# EAGLE schematic Robot (EAGLE 6.5.0)

## Sheet 1 of 4
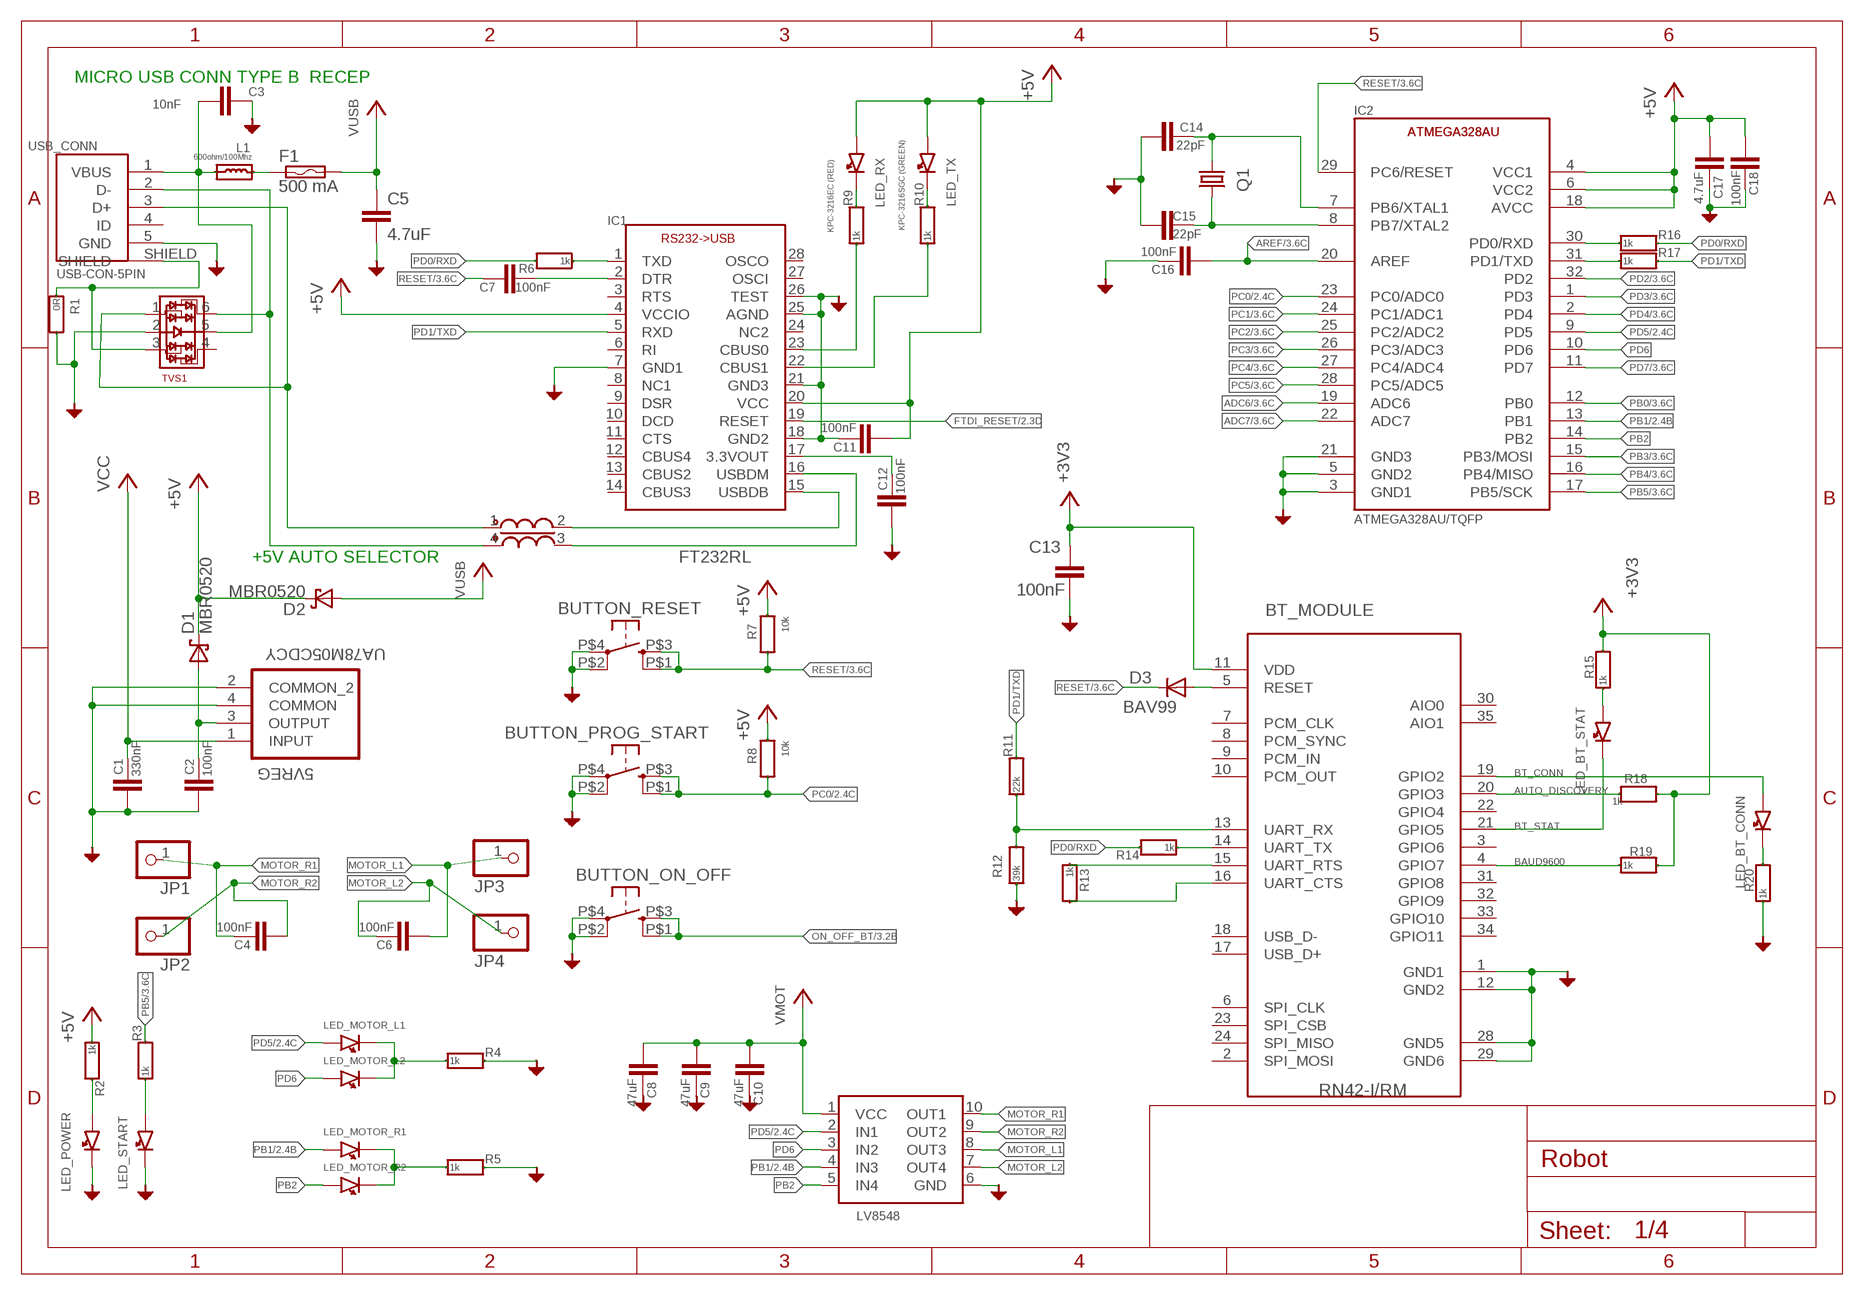
[diagram p0: schematic, sheet 1]

### Parts
5VREG  UA78M05CDCY  [SOT230P700X180-4N]
BT_MODULE  RN42-I/RM  BLUETOOTH-RN42"  [RN42]
BUTTON_ON_OFF  KSC921J  [TACT_SWITCH_4_PIN]
BUTTON_PROG_START  KSC921J  [TACT_SWITCH_4_PIN]
BUTTON_RESET  KSC921J  [TACT_SWITCH_4_PIN]
C1  330nF  C-EUC0805  [C0805]
C2  100nF  C-EUC0805  [C0805]
C3  10nF  C-EUC0805  [C0805]
C4  100nF  C-EUC0805  [C0805]
C5  4.7uF  C-EUC0805  [C0805]
C6  100nF  C-EUC0805  [C0805]
C7  100nF  C-EUC0805  [C0805]
C8  47uF  C-EUC1210  [C1210]
C9  47uF  C-EUC1210  [C1210]
C10  47uF  C-EUC1210  [C1210]
C11  100nF  C-EUC0805  [C0805]
C12  100nF  C-EUC0805  [C0805]
C13  100nF  C-EUC0805  [C0805]
C14  22pF  C-EUC0805  [C0805]
C15  22pF  C-EUC0805  [C0805]
C16  100nF  C-EUC0805  [C0805]
C17  4.7uF  C-EUC0805  [C0805]
C18  100nF  C-EUC0805  [C0805]
D1  MBR0520  [SOD123]
D2  MBR0520  [SOD123]
D3  BAV99  D-A1-C3  [SOT23]
F1  500 mA  POLYSWITCH  [PT1206]
IC1  FT232RL  [SSOP28]
IC2  ATMEGA328AU/TQFP  ATMEGA328AU  [TQFP32-08]
JP1  1X01 PIN  PINHD-1X1  [1X01]
JP2  1X01 PIN  PINHD-1X1  [1X01]
JP3  1X01 PIN  PINHD-1X1  [1X01]
JP4  1X01 PIN  PINHD-1X1  [1X01]
L1  600ohm/100Mhz  INDUCTOR_0603_600R  [R0603]
LED_BT_CONN  KPC-3216SGC  SMDLED_3216  [LED3216_PAC]
LED_BT_STAT  KPC-3216SGC  SMDLED_3216  [LED3216_PAC]
LED_MOTOR_L1  APT3216QBC/D (BLUE)  SMDLED_3216  [LED3216_PAC]
LED_MOTOR_L2  KPC-3216YC  SMDLED_3216  [LED3216_PAC]
LED_MOTOR_R1  APT3216QBC/D (BLUE)  SMDLED_3216  [LED3216_PAC]
LED_MOTOR_R2  KPC-3216YC  SMDLED_3216  [LED3216_PAC]
LED_POWER  KPC-3216SGC (GREEN)  SMDLED_3216  [LED3216_PAC]
LED_RX  KPC-3216EC (RED)  SMDLED_3216  [LED3216_PAC]
LED_START  KPC-3216SGC  SMDLED_3216  [LED3216_PAC]
LED_TX  KPC-3216SGC (GREEN)  SMDLED_3216  [LED3216_PAC]
MOTOR_CONTROLLER  LV8548  [LV8548]
Q1  16MHz  CRYSTALSM49  [SM49]
R1  0R  MYRES_0805  [R0805]
R2  1k  MYRES_0805  [R0805]
R3  1k  MYRES_0805  [R0805]
R4  1k  MYRES_0805  [R0805]
R5  1k  MYRES_0805  [R0805]
R6  1k  MYRES_0805  [R0805]
R7  10k  MYRES_0805  [R0805]
R8  10k  MYRES_0805  [R0805]
R9  1k  MYRES_0805  [R0805]
R10  1k  MYRES_0805  [R0805]
R11  22k  MYRES_0805  [R0805]
R12  39k  MYRES_0805  [R0805]
R13  1k  MYRES_0805  [R0805]
R14  1k  MYRES_0805  [R0805]
R15  1k  MYRES_0805  [R0805]
R16  1k  MYRES_0805  [R0805]
R17  1k  MYRES_0805  [R0805]
R18  1k  MYRES_0805  [R0805]
R19  1k  MYRES_0805  [R0805]
R20  1k  MYRES_0805  [R0805]
TVS1  PRTR5V0U4Y  [SOT363]
USB_CONN  USB-CON-5PIN  [USB-MICRO-MOLEX-105017-0001_V2]
USB_FILTER  SRF3216A  [SRF3216A]

### Nets
+3V3: BT_MODULE.11(VDD) C13.1 R15.2 R18.2 R19.2 ; also sheet 2,3
+5V: C11.2 C17.2 C18.2 D1.1(K) D2.1(K) IC1.4(VCCIO) IC1.20(VCC) IC2.4(VCC1) IC2.6(VCC2) IC2.18(AVCC) LED_RX.1 LED_TX.1 R2.1 R7.2 R8.2 ; also sheet 2,3,4
ADC6: IC2.19(ADC6) ; also sheet 3
ADC7: IC2.22(ADC7) ; also sheet 3
AREF: C16.2 IC2.20(AREF) ; also sheet 3
AUTO_DISCOVERY: BT_MODULE.20(GPIO3) R18.1
BAUD9600: BT_MODULE.4(GPIO7) R19.1
BT_CONN: BT_MODULE.19(GPIO2) LED_BT_CONN.1
BT_STAT: BT_MODULE.21(GPIO5) LED_BT_STAT.2
FTDI_RESET: IC1.19(RESET) ; also sheet 2
GND: 5VREG.2(COMMON_2) 5VREG.4(COMMON) BT_MODULE.1(GND1) BT_MODULE.12(GND2) BT_MODULE.28(GND5) BT_MODULE.29(GND6) BUTTON_ON_OFF.P$2 BUTTON_ON_OFF.P$4 BUTTON_PROG_START.P$2 BUTTON_PROG_START.P$4 BUTTON_RESET.P$2 BUTTON_RESET.P$4 C1.2 C2.2 C3.1 C5.2 C8.1 C9.1 C10.1 C11.1 C12.2 C13.2 C14.2 C15.2 C16.1 C17.1 C18.1 IC1.7(GND1) IC1.18(GND2) IC1.21(GND3) IC1.25(AGND) IC1.26(TEST) IC2.3(GND1) IC2.5(GND2) IC2.21(GND3) LED_POWER.2 LED_START.2 MOTOR_CONTROLLER.6(GND) R1.2 R4.2 R5.2 R12.1 R20.1 TVS1.2 USB_CONN.5(GND) ; also sheet 2,3,4
MOTOR_L1: C6.2 JP3.1 MOTOR_CONTROLLER.8(OUT3)
MOTOR_L2: C6.1 JP4.1 MOTOR_CONTROLLER.7(OUT4)
MOTOR_L_ON: LED_MOTOR_L1.2 LED_MOTOR_L2.2 R4.1
MOTOR_R1: C4.1 JP1.1 MOTOR_CONTROLLER.10(OUT1)
MOTOR_R2: C4.2 JP2.1 MOTOR_CONTROLLER.9(OUT2)
MOTOR_R_ON: LED_MOTOR_R1.2 LED_MOTOR_R2.2 R5.1
N$1: BT_MODULE.5(RESET) D3.1(A)
N$4: IC1.1(TXD) R6.1
N$5: LED_START.1 R3.1
N$7: BT_MODULE.14(UART_TX) R14.1
N$9: BT_MODULE.15(UART_RTS) R13.1
N$10: BT_MODULE.16(UART_CTS) R13.2
N$18: IC1.15(USBDB) USB_FILTER.2
N$19: LED_BT_STAT.1 R15.1
N$21: LED_BT_CONN.2 R20.2
N$25: IC1.16(USBDM) USB_FILTER.3
N$26: BT_MODULE.13(UART_RX) R11.1 R12.2
N$27: F1.1A F1.1B L1.1
N$38: 5VREG.3(OUTPUT) C2.1 D1.2(A)
N$41: C12.1 IC1.17(3.3VOUT)
N$53: C15.1 IC2.8(PB7/XTAL2) Q1.2
N$54: C14.1 IC2.7(PB6/XTAL1) Q1.1
N$57: TVS1.1 USB_CONN.3(D+) USB_FILTER.1
N$59: TVS1.6 USB_CONN.2(D-) USB_FILTER.4
N$82: C7.1 IC1.2(DTR)
N$83: C3.2 L1.2 TVS1.5 USB_CONN.1(VBUS)
N$85: IC1.23(CBUS0) R9.1
N$86: LED_RX.2 R9.2
N$87: LED_TX.2 R10.2
N$88: IC1.22(CBUS1) R10.1
N$89: LED_POWER.1 R2.2
N$90: IC2.30(PD0/RXD) R16.1
N$91: IC2.31(PD1/TXD) R17.1
ON_OFF_BT: BUTTON_ON_OFF.P$1 BUTTON_ON_OFF.P$3 ; also sheet 3
PB0: IC2.12(PB0) ; also sheet 3,4
PB1: IC2.13(PB1) LED_MOTOR_R1.1 MOTOR_CONTROLLER.4(IN3) ; also sheet 2
PB2: IC2.14(PB2) LED_MOTOR_R2.1 MOTOR_CONTROLLER.5(IN4)
PB3: IC2.15(PB3/MOSI) ; also sheet 3,4
PB4: IC2.16(PB4/MISO) ; also sheet 3,4
PB5: IC2.17(PB5/SCK) R3.2 ; also sheet 3
PC0: BUTTON_PROG_START.P$1 BUTTON_PROG_START.P$3 IC2.23(PC0/ADC0) R8.1 ; also sheet 2
PC1: IC2.24(PC1/ADC1) ; also sheet 3,4
PC2: IC2.25(PC2/ADC2) ; also sheet 3,4
PC3: IC2.26(PC3/ADC3) ; also sheet 3,4
PC4: IC2.27(PC4/ADC4) ; also sheet 3,4
PC5: IC2.28(PC5/ADC5) ; also sheet 3,4
PD0/RXD: R6.2 R14.2 R16.2
PD1/TXD: IC1.5(RXD) R11.2 R17.2
PD2: IC2.32(PD2) ; also sheet 3
PD3: IC2.1(PD3) ; also sheet 3
PD4: IC2.2(PD4) ; also sheet 3,4
PD5: IC2.9(PD5) LED_MOTOR_L1.1 MOTOR_CONTROLLER.2(IN1) ; also sheet 2
PD6: IC2.10(PD6) LED_MOTOR_L2.1 MOTOR_CONTROLLER.3(IN2)
PD7: IC2.11(PD7) ; also sheet 3,4
RESET: BUTTON_RESET.P$1 BUTTON_RESET.P$3 C7.2 D3.3(C) IC2.29(PC6/RESET) R7.1 ; also sheet 3
SHIELD: R1.1 TVS1.3 USB_CONN.SHIELD
USB_VCC: C5.1 D2.2(A) F1.2A F1.2B ; supply symbol labelled VUSB ; also sheet 2,3
VCC: 5VREG.1(INPUT) C1.1 ; also sheet 3
VMOT: C8.2 C9.2 C10.2 MOTOR_CONTROLLER.1(VCC) ; also sheet 3
Unconnected: BT_MODULE.2(SPI_MOSI) BT_MODULE.3(GPIO6) BT_MODULE.6(SPI_CLK) BT_MODULE.7(PCM_CLK) BT_MODULE.8(PCM_SYNC) BT_MODULE.9(PCM_IN) BT_MODULE.10(PCM_OUT) BT_MODULE.17(USB_D+) BT_MODULE.18(USB_D-) BT_MODULE.22(GPIO4) BT_MODULE.23(SPI_CSB) BT_MODULE.24(SPI_MISO) BT_MODULE.30(AIO0) BT_MODULE.31(GPIO8) BT_MODULE.32(GPIO9) BT_MODULE.33(GPIO10) BT_MODULE.34(GPIO11) BT_MODULE.35(AIO1) IC1.3(RTS) IC1.6(RI) IC1.8(NC1) IC1.9(DSR) IC1.10(DCD) IC1.11(CTS) IC1.12(CBUS4) IC1.13(CBUS2) IC1.14(CBUS3) IC1.24(NC2) IC1.27(OSCI) IC1.28(OSCO) TVS1.4 USB_CONN.4(ID)

### Notes on the sheet
- MICRO USB CONN TYPE B  RECEP
- +5V AUTO SELECTOR

## Sheet 2 of 4
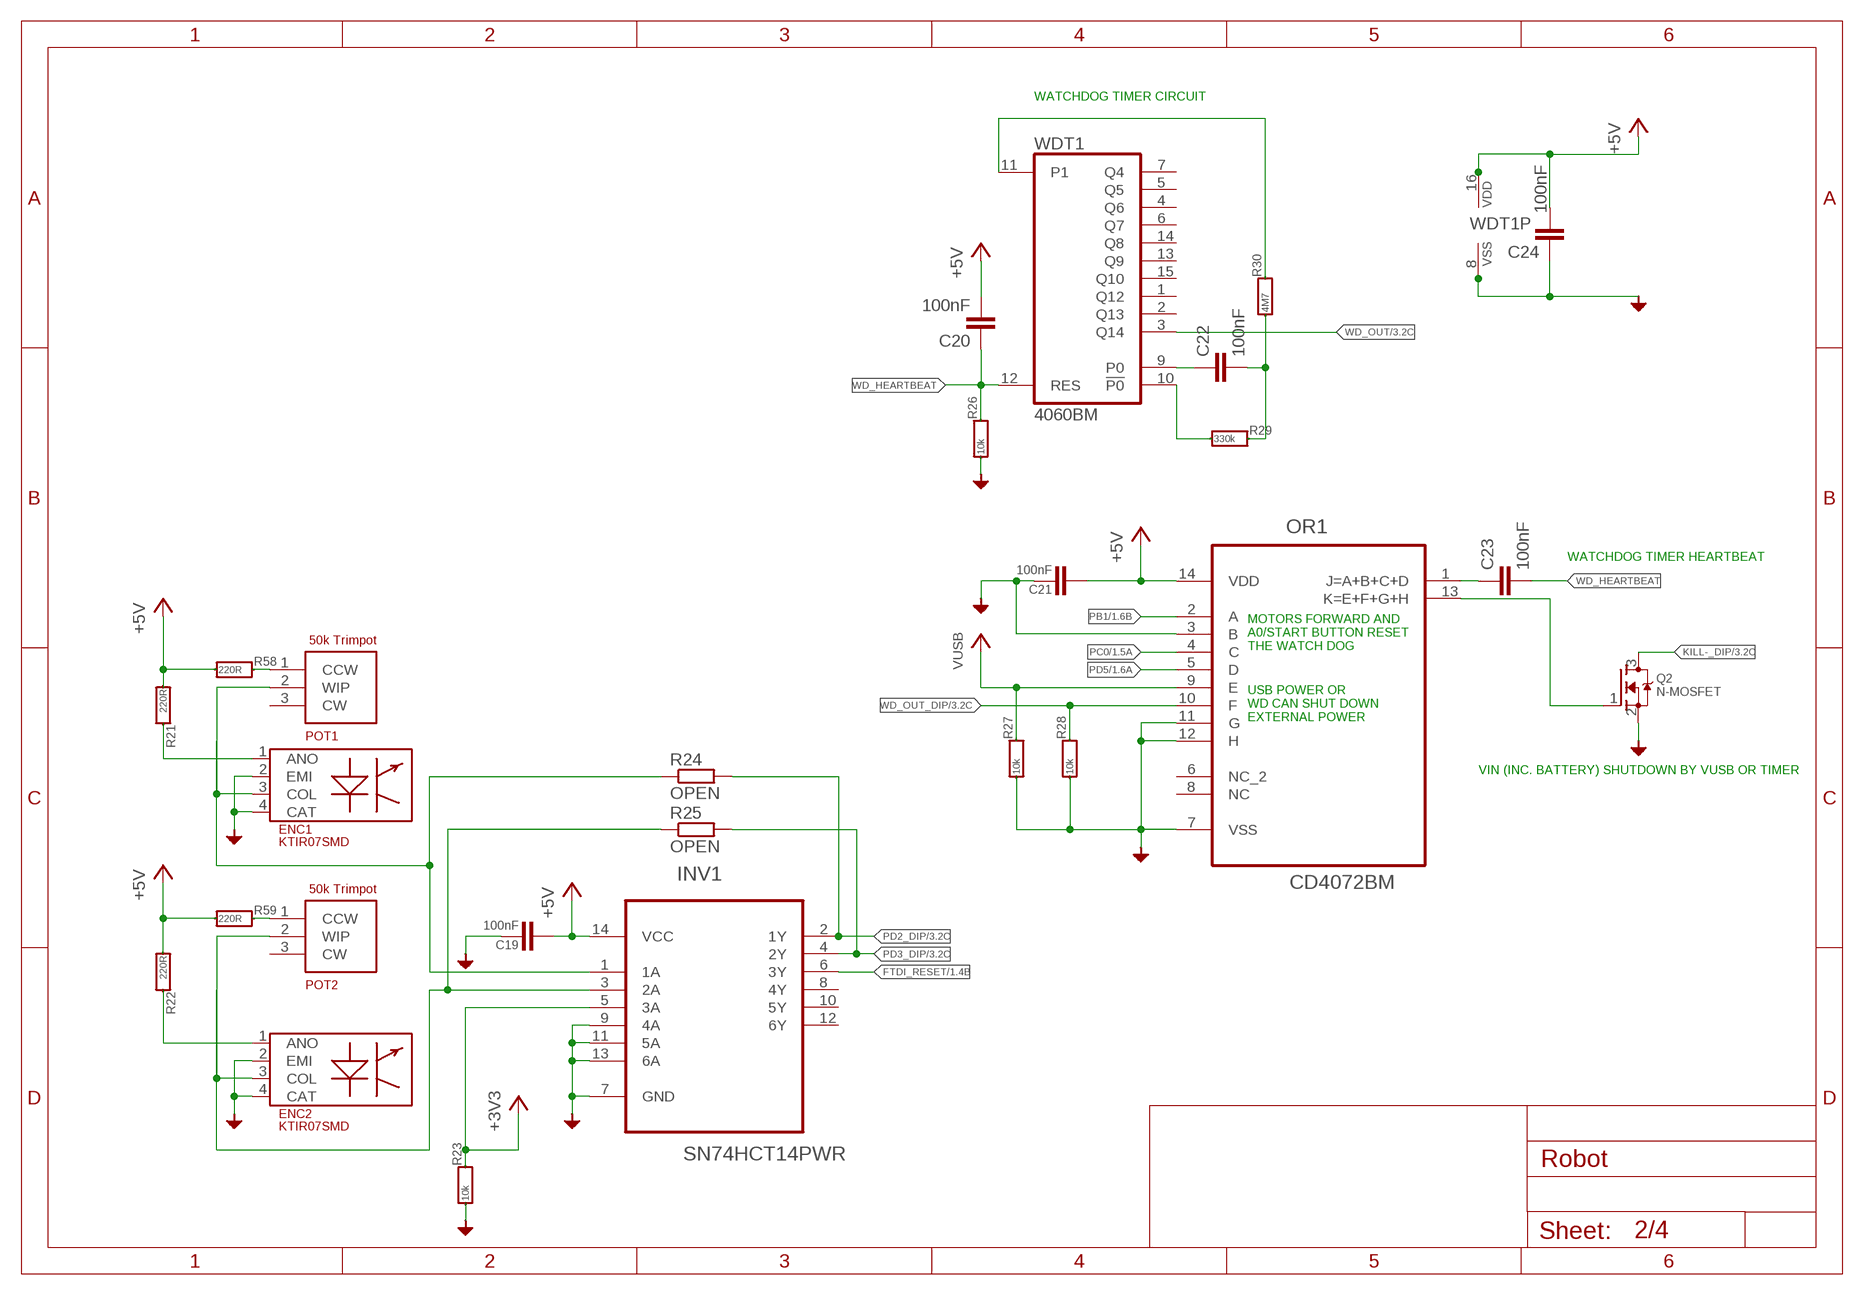
[diagram p1: schematic, sheet 2]

### Parts
C19  100nF  C-EUC0805  [C0805]
C20  100nF  C-EUC0805  [C0805]
C21  100nF  C-EUC0805  [C0805]
C22  100nF  C-EUC0805  [C0805]
C23  100nF  C-EUC0805  [C0805]
C24  100nF  C-EUC0805  [C0805]
ENC1  KTIR07SMD  [KTIR07]
ENC2  KTIR07SMD  [KTIR07]
INV1  SN74HCT14PWR  [SOP65P640X120-14N]
OR1  CD4072BM  [SOIC127P600X175-14N]
POT1  TC33-TRIMPOT  [TC33-TRIMPOT]
POT2  TC33-TRIMPOT  [TC33-TRIMPOT]
Q2  N-MOSFET  MOSFET-NREFLOW  [SOT23]
R21  220R  MYRES_0805  [R0805]
R22  220R  MYRES_0805  [R0805]
R23  10k  MYRES_0805  [R0805]
R24  OPEN  R-EU_R0805  [R0805]
R25  OPEN  R-EU_R0805  [R0805]
R26  10k  MYRES_0805  [R0805]
R27  10k  MYRES_0805  [R0805]
R28  10k  MYRES_0805  [R0805]
R29  330k  MYRES_0805  [R0805]
R30  4M7  MYRES_0805  [R0805]
R58  220R  MYRES_0805  [R0805]
R59  220R  MYRES_0805  [R0805]
WDT1  4060BM  4060D  [SO16]

### Nets
+3V3: INV1.5(3A) R23.2 ; also sheet 1,3
+5V: C19.2 C20.2 C21.2 C24.2 INV1.14(VCC) OR1.14(VDD) R21.1 R22.1 R58.1 R59.1 WDT1.16(VDD) ; also sheet 1,3,4
FTDI_RESET: INV1.6(3Y) ; also sheet 1
GND: C19.1 C21.1 C24.1 ENC1.2(EMI) ENC1.4(CAT) ENC2.2(EMI) ENC2.4(CAT) INV1.7(GND) INV1.9(4A) INV1.11(5A) INV1.13(6A) OR1.3(B) OR1.7(VSS) OR1.11(G) OR1.12(H) Q2.2(S) R23.1 R26.1 R27.1 R28.1 WDT1.8(VSS) ; also sheet 1,3,4
KILL-_DIP: Q2.3(D) ; also sheet 3
N$12: C23.1 OR1.1(J=A+B+C+D)
N$29: ENC1.1(ANO) R21.2
N$31: ENC2.1(ANO) R22.2
N$33: ENC2.3(COL) INV1.3(2A) POT2.2(WIP) R25.1
N$34: R29.1 WDT1.10(!P0)
N$35: ENC1.3(COL) INV1.1(1A) POT1.2(WIP) R24.1
N$43: C22.1 WDT1.9(P0)
N$44: POT2.1(CCW) R59.2
N$45: R30.2 WDT1.11(P1)
N$48: POT1.1(CCW) R58.2
N$49: C22.2 R29.2 R30.1
PB1: OR1.2(A) ; also sheet 1
PC0: OR1.4(C) ; also sheet 1
PD2_DIP: INV1.2(1Y) R24.2 ; also sheet 3
PD3_DIP: INV1.4(2Y) R25.2 ; also sheet 3
PD5: OR1.5(D) ; also sheet 1
USB/WD_KILL-: OR1.13(K=E+F+G+H) Q2.1(G)
USB_VCC: OR1.9(E) R27.2 ; supply symbol labelled VUSB ; also sheet 1,3
WD_HEARTBEAT: C20.1 C23.2 R26.2 WDT1.12(RES)
WD_OUT: WDT1.3(Q14) ; also sheet 3
WD_OUT_DIP: OR1.10(F) R28.2 ; also sheet 3
Unconnected: INV1.8(4Y) INV1.10(5Y) INV1.12(6Y) OR1.6(NC_2) OR1.8(NC) POT1.3(CW) POT2.3(CW) WDT1.1(Q12) WDT1.2(Q13) WDT1.4(Q6) WDT1.5(Q5) WDT1.6(Q7) WDT1.7(Q4) WDT1.13(Q9) WDT1.14(Q8) WDT1.15(Q10)

### Notes on the sheet
- WATCHDOG TIMER CIRCUIT
- WATCHDOG TIMER HEARTBEAT
- MOTORS FORWARD AND 
  A0/START BUTTON RESET
  THE WATCH DOG
- USB POWER OR
  WD CAN SHUT DOWN
  EXTERNAL POWER
- VIN (INC. BATTERY) SHUTDOWN BY VUSB OR TIMER

## Sheet 3 of 4
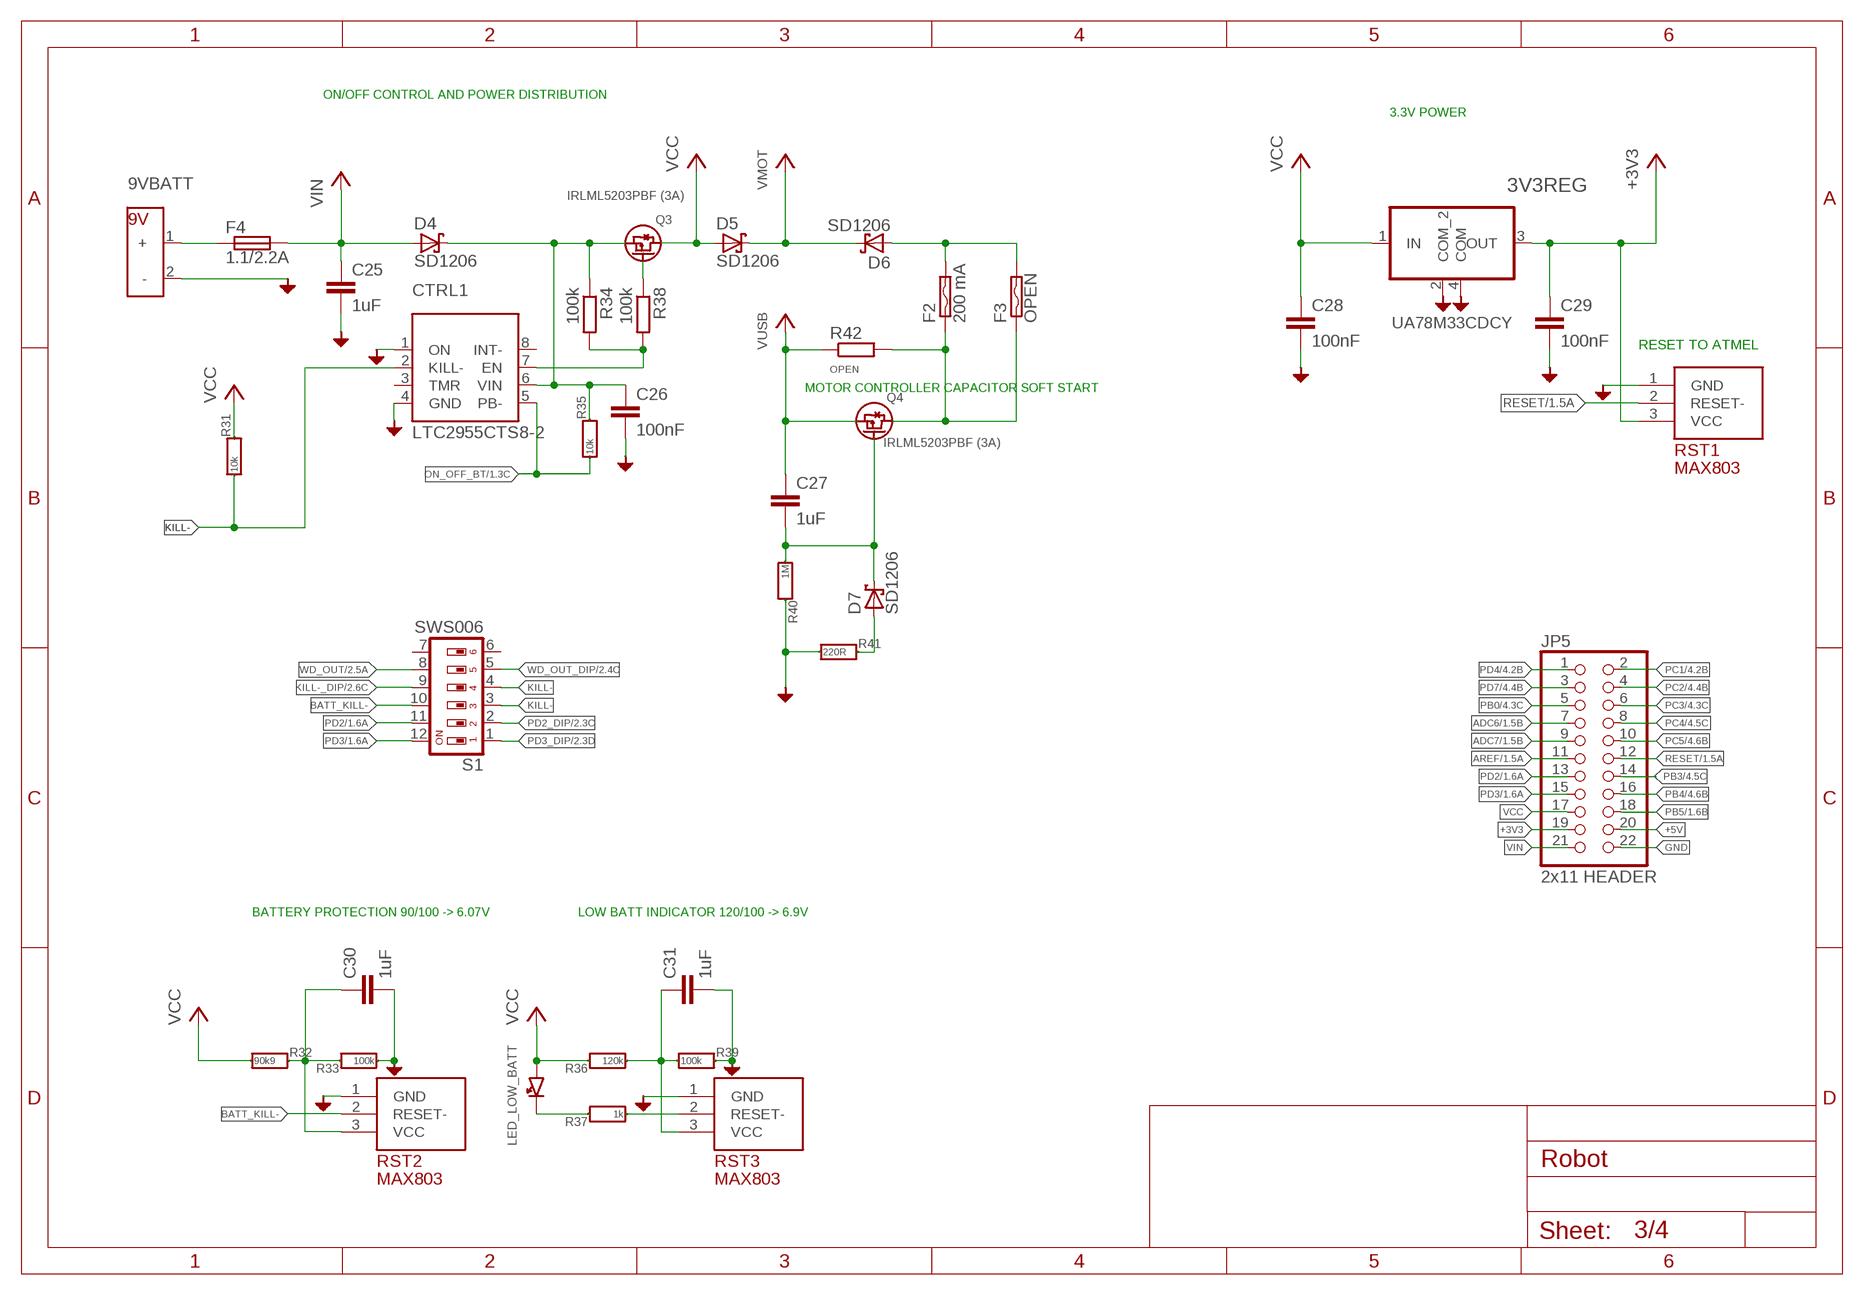
[diagram p2: schematic, sheet 3]

### Parts
3V3REG  UA78M33CDCY  [SOT230P700X180-4N]
9VBATT  BATTERY_9V  [BATTERY_PAC]
C25  1uF  C-EUC0805  [C0805]
C26  100nF  C-EUC0805  [C0805]
C27  1uF  C-EUC0805  [C0805]
C28  100nF  C-EUC0805  [C0805]
C29  100nF  C-EUC0805  [C0805]
C30  1uF  C-EUC0805  [C0805]
C31  1uF  C-EUC0805  [C0805]
CTRL1  LTC2955CTS8-2  [8TSOT23]
D4  SD1206  [SD1206]
D5  SD1206  [SD1206]
D6  SD1206  [SD1206]
D7  SD1206  [SD1206]
F2  200 mA  POLYSWITCH  [PT1206]
F3  OPEN  POLYSWITCH  [PT1206]
F4  1.1/2.2A  POLYSWITCH_1812C1812  [C1812]
JP5  2x11 HEADER  PINHD-2X11  [2X11]
LED_LOW_BATT  KPC-3216EC (RED)  SMDLED_3216  [LED3216_PAC]
Q3  IRLML5203PBF (3A)  PFET  [SOT23]
Q4  IRLML5203PBF (3A)  PFET  [SOT23]
R31  10k  MYRES_0805  [R0805]
R32  90k9  MYRES_0805  [R0805]
R33  100k  MYRES_0805  [R0805]
R34  100k  R-EU_R0805  [R0805]
R35  10k  MYRES_0805  [R0805]
R36  120k  MYRES_0805  [R0805]
R37  1k  MYRES_0805  [R0805]
R38  100k  R-EU_R0805  [R0805]
R39  100k  MYRES_0805  [R0805]
R40  1M  MYRES_0805  [R0805]
R41  220R  MYRES_0805  [R0805]
R42  OPEN  R-EU_R0603  [R0603]
RST1  MAX803SC  [SC70-3L]
RST2  MAX803SC  [SC70-3L]
RST3  MAX803SC  [SC70-3L]
S1  SWS006  [SMS-006]

### Nets
+3V3: 3V3REG.3(OUT) C29.1 JP5.19 RST1.3(VCC) ; also sheet 1,2
+5V: JP5.20 ; also sheet 1,2,4
ADC6: JP5.7 ; also sheet 1
ADC7: JP5.9 ; also sheet 1
AREF: JP5.11 ; also sheet 1
BATT_KILL-: RST2.2(RESET-) S1.10
BATT_PROT_ADJ: C30.1 R32.2 R33.2 RST2.3(VCC)
GND: 3V3REG.2(COM_2) 3V3REG.4(COM) 9VBATT.2(-) C25.2 C26.2 C28.2 C29.2 C30.2 C31.2 CTRL1.1(ON) CTRL1.4(GND) JP5.22 R33.1 R39.2 R40.2 R41.1 RST1.1(GND) RST2.1(GND) RST3.1(GND) ; also sheet 1,2,4
KILL-: CTRL1.2(KILL-) R31.1 S1.3 S1.4
KILL-_DIP: S1.9 ; also sheet 2
N$2: Q3.1(G) R38.1
N$6: CTRL1.7(EN) R34.2 R38.2
N$8: LED_LOW_BATT.2 R37.2
N$17: D6.ANODE(A) F2.2A F2.2B F3.2A F3.2B
N$30: R37.1 RST3.2(RESET-)
N$37: F2.1A F2.1B F3.1A F3.1B Q4.3(D) R42.2
N$39: C27.2 D7.CATHODE(C) Q4.1(G) R40.1
N$42: C26.1 CTRL1.6(VIN) D4.CATHODE(C) Q3.2(S) R34.1 R35.2
N$46: D7.ANODE(A) R41.2
N$50: 9VBATT.1(+) F4.2
N$64: C31.1 R36.1 R39.1 RST3.3(VCC)
ON_OFF_BT: CTRL1.5(PB-) R35.1 ; also sheet 1
PB0: JP5.5 ; also sheet 1,4
PB3: JP5.14 ; also sheet 1,4
PB4: JP5.16 ; also sheet 1,4
PB5: JP5.18 ; also sheet 1
PC1: JP5.2 ; also sheet 1,4
PC2: JP5.4 ; also sheet 1,4
PC3: JP5.6 ; also sheet 1,4
PC4: JP5.8 ; also sheet 1,4
PC5: JP5.10 ; also sheet 1,4
PD2: JP5.13 S1.11 ; also sheet 1
PD2_DIP: S1.2 ; also sheet 2
PD3: JP5.15 S1.12 ; also sheet 1
PD3_DIP: S1.1 ; also sheet 2
PD4: JP5.1 ; also sheet 1,4
PD7: JP5.3 ; also sheet 1,4
RESET: JP5.12 RST1.2(RESET-) ; also sheet 1
USB_VCC: C27.1 Q4.2(S) R42.1 ; supply symbol labelled VUSB ; also sheet 1,2
VCC: 3V3REG.1(IN) C28.1 D5.ANODE(A) JP5.17 LED_LOW_BATT.1 Q3.3(D) R31.2 R32.1 R36.2 ; also sheet 1
VIN: C25.1 D4.ANODE(A) F4.1 JP5.21
VMOT: D5.CATHODE(C) D6.CATHODE(C) ; also sheet 1
WD_OUT: S1.8 ; also sheet 2
WD_OUT_DIP: S1.5 ; also sheet 2
Unconnected: CTRL1.3(TMR) CTRL1.8(INT-) S1.6 S1.7

### Notes on the sheet
- ON/OFF CONTROL AND POWER DISTRIBUTION
- 3.3V POWER
- RESET TO ATMEL
- MOTOR CONTROLLER CAPACITOR SOFT START
- LOW BATT INDICATOR 120/100 -> 6.9V
- BATTERY PROTECTION 90/100 -> 6.07V

## Sheet 4 of 4
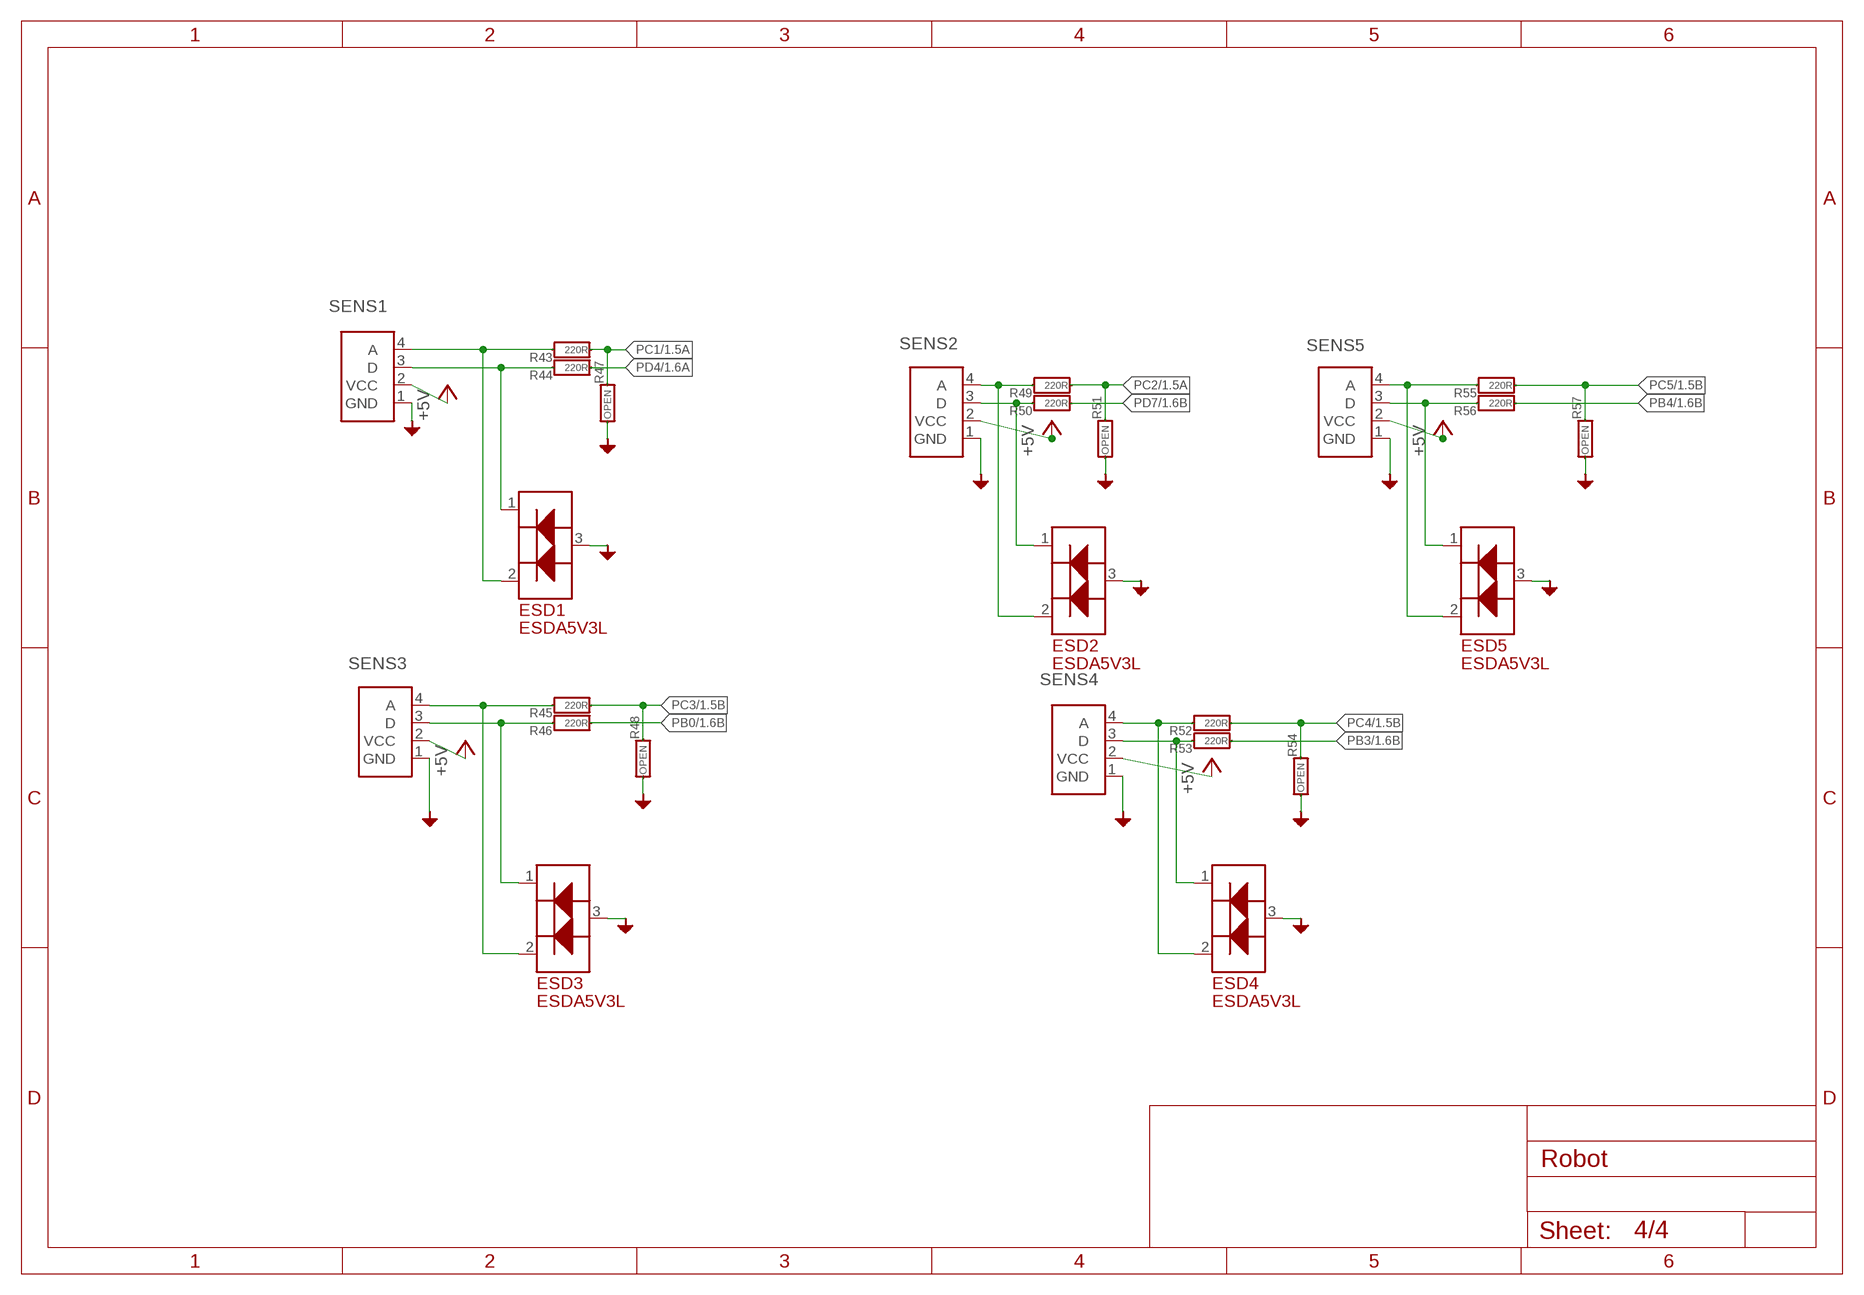
[diagram p3: schematic, sheet 4]

### Parts
ESD1  ESDA5V3L  [SOT23]
ESD2  ESDA5V3L  [SOT23]
ESD3  ESDA5V3L  [SOT23]
ESD4  ESDA5V3L  [SOT23]
ESD5  ESDA5V3L  [SOT23]
R43  220R  MYRES_0805  [R0805]
R44  220R  MYRES_0805  [R0805]
R45  220R  MYRES_0805  [R0805]
R46  220R  MYRES_0805  [R0805]
R47  OPEN  MYRES_0805  [R0805]
R48  OPEN  MYRES_0805  [R0805]
R49  220R  MYRES_0805  [R0805]
R50  220R  MYRES_0805  [R0805]
R51  OPEN  MYRES_0805  [R0805]
R52  220R  MYRES_0805  [R0805]
R53  220R  MYRES_0805  [R0805]
R54  OPEN  MYRES_0805  [R0805]
R55  220R  MYRES_0805  [R0805]
R56  220R  MYRES_0805  [R0805]
R57  OPEN  MYRES_0805  [R0805]
SENS1  ROBOT_SENSOR  [ROBOT_SENSOR]
SENS2  ROBOT_SENSOR  [ROBOT_SENSOR]
SENS3  ROBOT_SENSOR  [ROBOT_SENSOR]
SENS4  ROBOT_SENSOR  [ROBOT_SENSOR]
SENS5  ROBOT_SENSOR  [ROBOT_SENSOR]

### Nets
+5V: SENS1.2(VCC) SENS2.2(VCC) SENS3.2(VCC) SENS4.2(VCC) SENS5.2(VCC) ; also sheet 1,2,3
GND: ESD1.3 ESD2.3 ESD3.3 ESD4.3 ESD5.3 R47.1 R48.1 R51.1 R54.1 R57.1 SENS1.1(GND) SENS2.1(GND) SENS3.1(GND) SENS4.1(GND) SENS5.1(GND) ; also sheet 1,2,3
N$3: ESD4.2 R52.2 SENS4.4(A)
N$13: ESD4.1 R53.2 SENS4.3(D)
N$14: ESD3.2 R45.2 SENS3.4(A)
N$15: ESD1.2 R43.2 SENS1.4(A)
N$16: ESD5.2 R55.2 SENS5.4(A)
N$20: ESD5.1 R56.2 SENS5.3(D)
N$22: ESD2.2 R49.2 SENS2.4(A)
N$23: ESD2.1 R50.2 SENS2.3(D)
N$28: ESD1.1 R44.2 SENS1.3(D)
N$32: ESD3.1 R46.2 SENS3.3(D)
PB0: R46.1 ; also sheet 1,3
PB3: R53.1 ; also sheet 1,3
PB4: R56.1 ; also sheet 1,3
PC1: R43.1 R47.2 ; also sheet 1,3
PC2: R49.1 R51.2 ; also sheet 1,3
PC3: R45.1 R48.2 ; also sheet 1,3
PC4: R52.1 R54.2 ; also sheet 1,3
PC5: R55.1 R57.2 ; also sheet 1,3
PD4: R44.1 ; also sheet 1,3
PD7: R50.1 ; also sheet 1,3

## Library data of the parts
3V3REG = sduino:UA78M33CDCY: IC, LINEAR VOLT REGULATOR, 3.3V, SOT-223-4; MF: TEXAS INSTRUMENTS; MPN: UA78M33CDCY; OC_FARNELL: 2296031; OC_NEWARK: 03P0895; PACKAGE: SOT-223-4; SUPPLIER: TEXAS INSTRUMENTS
5VREG = sduino:UA78M05CDCY: IC, LINEAR VOLT REGULATOR, 5V; MF: TEXAS INSTRUMENTS; MPN: UA78M05CDCY; OC_FARNELL: 2296030; OC_NEWARK: 77C1885; PACKAGE: SOT-223-3; SUPPLIER: TEXAS INSTRUMENTS
9VBATT = MyLibrary1:BATTERY_9V; MF: KEYSTONE; MPN: 967; OC_FARNELL: 1888429
BT_MODULE = sduino:BLUETOOTH-RN42: Bluetooth SMD module; MF: MICROCHIP; MPN: RN42-I/RM; OC_FARNELL: 2143310
BUTTON_ON_OFF BUTTON_PROG_START BUTTON_RESET = sduino:KSC921J: Tactile Switch; MF: C & K COMPONENTS; MPN: KSC921J LFS; OC_FARNELL: 2435155
C1 = rcl:C-EU: CAPACITOR, European symbol; MF: AVX; MPN: 08053C334KAT2A; OC_FARNELL: 1833878
C2 C4 C6 C7 C11 C12 C16 C18-C24 C26 C28 C29 = rcl:C-EU: CAPACITOR, European symbol; MF: AVX; MPN: 08055C104KAT2A; OC_FARNELL: 499687
C3 = rcl:C-EU: CAPACITOR, European symbol; MF: MULTICOMP; MPN: MC0805B103K500CT; OC_FARNELL: 1759246
C5 C17 = rcl:C-EU: CAPACITOR, European symbol; MF: MURATA; MPN: GRM21BR61E475KA12L; OC_FARNELL: 1735529
C8-C10 = rcl:C-EU: CAPACITOR, European symbol; MF: MURATA; MPN: GRM32EC81C476KE15L; OC_FARNELL: 1907527
C13 = resistor:C-EU: CAPACITOR, European symbol; MF: AVX; MPN: 08055C104KAT2A; OC_FARNELL: 499687
C14 C15 = rcl:C-EU: CAPACITOR, European symbol; MF: YAGEO (PHYCOMP); MPN: CC0805JRNPO9BN220; OC_FARNELL: 1362555
C25 C27 C30 C31 = rcl:C-EU: CAPACITOR, European symbol; MF: WALSIN; MPN: 0805B104K500CT; OC_FARNELL: 2496944
CTRL1 = MyLibrary1:LTC2955CTS8-2; MF: LINEAR TECHNOLOGY; MPN: LTC2955CTS8-2#TRMPBF; OC_FARNELL: 2097940
D1 D2 = sduino:MBR0520: Schottky diode; MF: FAIRCHILD SEMICONDUCTOR; MPN: MBR0520L; OC_FARNELL: 1467521
D3 = MyLibrary1:D-: DIODE unfilled; MF: MULTICOMP; MPN: BAV99; OC_FARNELL: 1621837
D4-D7 = sduino:SD1206; FARNELL: 2400198; MF: AVX; MPN: SD1206S040S2R0; OC_FARNELL: 2400198
ENC1 ENC2 = sduino:KTIR07; MF: KINGBRIGHT; MPN: KTIR0711S; OC_FARNELL: 2079966
ESD1-ESD5 = sduino:ESDA5V3L; MF: STMICROELECTRONICS; MPN: ESDA5V3L; OC_FARNELL: 1749266
F1 = sduino:POLYSWITCH: SMD PolySwitch; MF: TE CONNECTIVITY / RAYCHEM; MPN: NANOSMDC050F/13.2-2; OC_FARNELL: 1345942
F2 = sduino:POLYSWITCH: SMD PolySwitch; MF: TE CONNECTIVITY / RAYCHEM; MPN: NANOSMDC020F-2; OC_FARNELL: 1345939
F3 = sduino:POLYSWITCH: SMD PolySwitch; OC_FARNELL: unknown
F4 = sduino:POLYSWITCH_1812; FARNELL: 2473642; MF: TE CONNECTIVITY / RAYCHEM; MPN: MINISMDC110F/16-2; OC_FARNELL: 2473642
IC1 = maxim:FT232RL; MF: FTDI; MPN: FT232RL-REEL; OC_FARNELL: 1146032
IC2 = atmel:ATMEGA328AU; MF: ATMEL; MPN: ATMEGA328P-AU; OC_FARNELL: 1715486
INV1 = sduino:SN74HCT14PWR: QUADRUPLE FET BUS SWITCH 2.5-V/3.3-V LOW-VOLTAGE BUS SWITCH WITH 5-V-TOLERANT LEVEL SHIFTER; MF: NXP; MPN: 74HCT14PW,118; OC_FARNELL: 2438727; PACKAGE: TSSOP-14
JP1-JP4 = pinhead:PINHD-1X1: PIN HEADER; MF: WURTH ELEKTRONIK; MPN: 61300111121; OC_FARNELL: 2356152
JP5 = pinhead:PINHD-2X11: PIN HEADER; MF: MULTICOMP; MPN: 2214S-22SG-85; OC_FARNELL: 1593495
L1 = MyLibrary1:INDUCTOR_0603_600R; MF: WURTH ELEKTRONIK; MPN: 742792651; OC_FARNELL: 1635706
LED_BT_CONN LED_BT_STAT LED_POWER LED_START LED_TX = MyLibrary1:SMDLED_3216; MF: KINGBRIGHT; MPN: KPC-3216SGC; OC_FARNELL: 1318254
LED_LOW_BATT LED_RX = MyLibrary1:SMDLED_3216; MF: KINGBRIGHT; MPN: KPC-3216EC; OC_FARNELL: 1318250RL
LED_MOTOR_L1 LED_MOTOR_R1 = MyLibrary1:SMDLED_3216; MF: KINGBRIGHT; MOUSER_PART_NO: 604-APT3216QBC/D; MPN: KP-3216QBC-D; OC_FARNELL: 2217976
LED_MOTOR_L2 LED_MOTOR_R2 = MyLibrary1:SMDLED_3216; MF: KINGBRIGHT; MPN: KPC-3216YC; OC_FARNELL: 1318264RL
MOTOR_CONTROLLER = sduino:LV8548; MF: ON SEMICONDUCTOR; MPN: LV8548MC-AH; OC_FARNELL: 2217011
OR1 = Texas Instruments_By_element14_Batch_1:CD4072BM: CMOS OR Gates; MF: TEXAS INSTRUMENTS; MPN: CD4072BM; OC_FARNELL: 1753434; OC_NEWARK: 34R6869; PACKAGE: SOIC-14; SUPPLIER: Texas Instruments
POT1 POT2 = sduino:TC33-TRIMPOT; MF: BOURNS; MPN: TC33X-2-503E; OC_FARNELL: 1689867
Q1 = crystal:CRYSTAL: CRYSTAL; MF: IQD FREQUENCY PRODUCTS; MPN: LFXTAL003237; OC_FARNELL: 9713808; OC_NEWARK: unknown
Q2 = adafruit:MOSFET-N: N-Channel Mosfet 2N7002E - 60V 260mA SOT23 [Digikey: 2N7002ET1GOSTR-ND] - REEL BSH103 - 30V 850mA SOT23 [Digikey: 568-5013-1-ND]; MF: FAIRCHILD SEMICONDUCTOR; MPN: FDV301N; OC_FARNELL: 9845011
Q3 Q4 = MyLibrary1:PFET; MF: INTERNATIONAL RECTIFIER; MPN: IRLML5203PBF; OC_FARNELL: 9103511
R1 = rcl:MYRES_0805; MF: MULTICOMP; MPN: MC01W08050R; OC_FARNELL: 9333681
R2-R6 R9 R10 R13-R20 R37 = rcl:MYRES_0805; MF: VISHAY DRALORIC; MPN: CRCW08051K00FKTA; OC_FARNELL: 1652936
R7 R8 R23 R26-R28 R31 R35 = rcl:MYRES_0805; MF: YAGEO (PHYCOMP); MPN: RC0805FR-0710KL; OC_FARNELL: 9237755
R11 = rcl:MYRES_0805; MF: WELWYN; MPN: WCR0805-22KFI; OC_FARNELL: 1099809
R12 = rcl:MYRES_0805; MF: WELWYN; MPN: WCR0805-39KFI; OC_FARNELL: 1100325
R21 R22 R41 R43-R46 R49 R50 R52 R53 R55 R56 R58 R59 = rcl:MYRES_0805; MF: MULTICOMP; MPN: MCWR08X2200FTL; OC_FARNELL: 2447606
R24 R25 R42 = resistor:R-EU_: RESISTOR, European symbol; OC_FARNELL: unknown
R29 = rcl:MYRES_0805; MF: VISHAY DRALORIC; MPN: CRCW0805330KFKEA; OC_FARNELL: 1652983
R30 = rcl:MYRES_0805; MF: VISHAY DRALORIC; MPN: RCV08054M70FKEA; OC_FARNELL: 2352630
R32 = rcl:MYRES_0805; MF: MULTICOMP; MPN: MC01W0805190K9; OC_FARNELL: 2141897
R33 R39 = rcl:MYRES_0805; MF: YAGEO (PHYCOMP); MPN: RC0805FR-07100KL; OC_FARNELL: 9237879
R34 R38 = resistor:R-EU_: RESISTOR, European symbol; MF: YAGEO (PHYCOMP); MPN: RC0805FR-07100KL; OC_FARNELL: 9237879
R36 = rcl:MYRES_0805; MF: YAGEO (PHYCOMP); MPN: RC0805FR-07120KL; OC_FARNELL: 9237887
R40 = rcl:MYRES_0805; MF: VISHAY DALE; MPN: CRCW08051M00FKTB; OC_FARNELL: 1853267
R47 R48 R51 R54 R57 = rcl:MYRES_0805; OC_FARNELL: unknown
RST1-RST3 = sduino:MAX803; MF: ON SEMICONDUCTOR; MPN: MAX803SQ293T1G; OC_FARNELL: 2318552
S1 = smd-special:SWS006: SMD Dip Switch 6 pol.; MF: MULTICOMP; MPN: MCDM(R)-06-T; OC_FARNELL: 9472045
SENS1-SENS5 = sduino:ROBOT_SENSOR; OC_FARNELL: unknown
TVS1 = sduino:PRTR5V0U4Y; MF: NXP; MPN: PRTR5V0U4Y,125; OC_FARNELL: 1757870
USB_CONN = sduino:USB-CON-5PIN: Molex Micro USB 105017-0001; MF: MOLEX; MPN: 105017-0001; OC_FARNELL: 2293836
USB_FILTER = sduino:SRF3216A; MF: BOURNS; MPN: SRF3216A-900Y; OC_FARNELL: 2493828
WDT1 = 40xx:4060: 14-stage binary/ripple COUNTER; MF: TEXAS INSTRUMENTS; MPN: CD4060BM; OC_FARNELL: 1741260